# EAGLE design R2D2 Main Board (EAGLE 9.5.2)
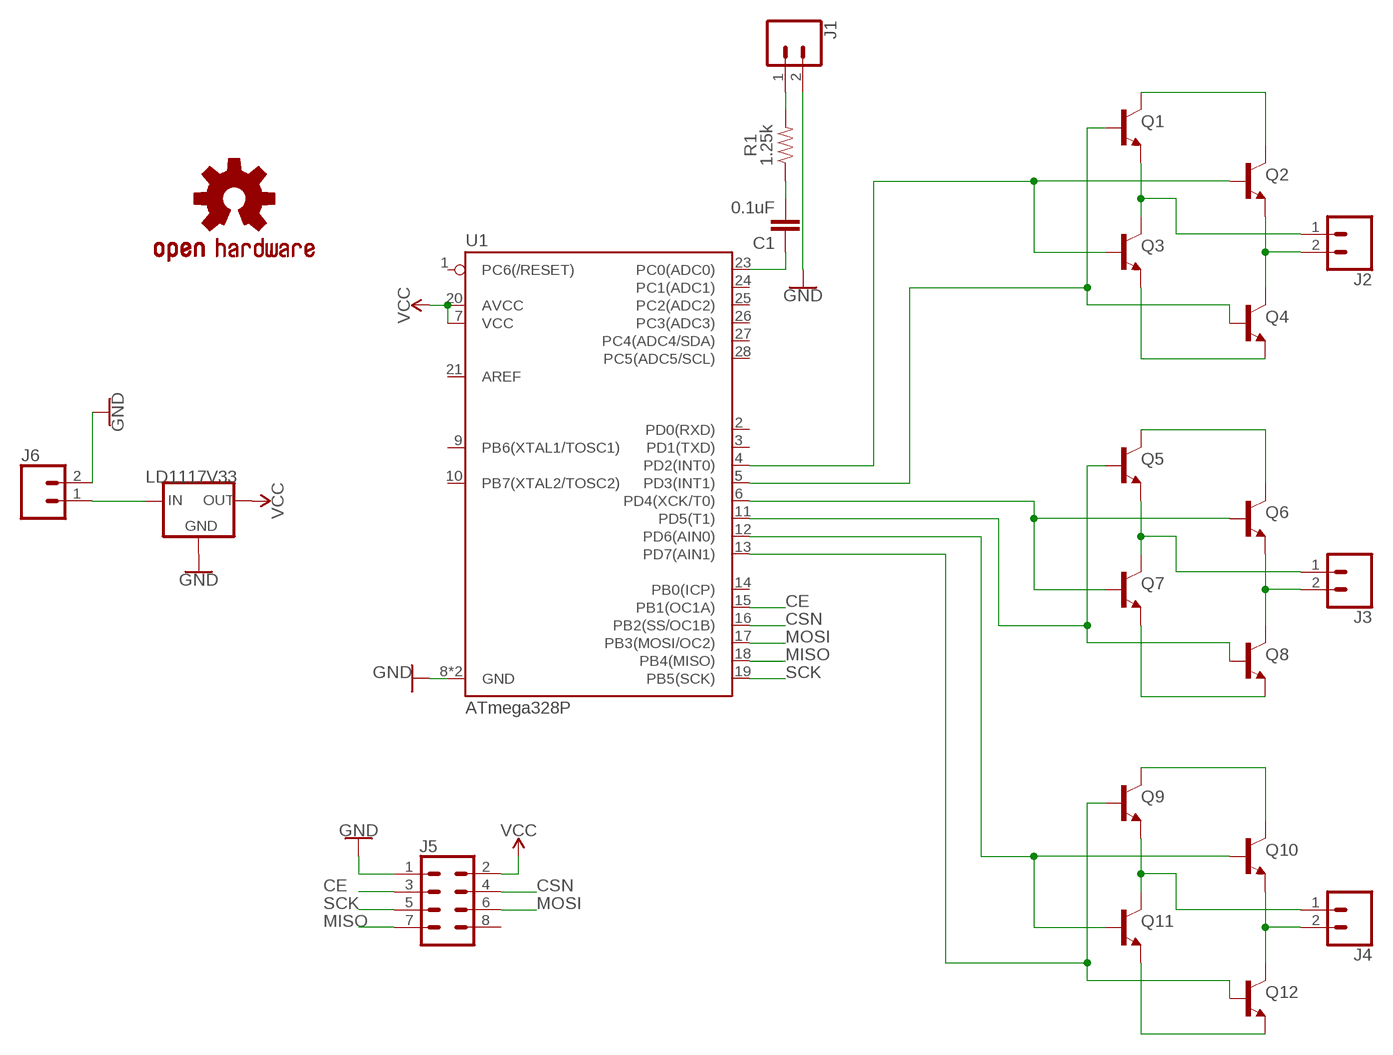
[diagram p0: schematic, sheet 1]

## Parts
C1  0.1uF  0.1UF-KIT-EZ-50V-20%  [CAP-PTH-SMALL-KIT]
J1  CONN_02  [1X02]
J2  CONN_02  [1X02]
J3  CONN_02  [1X02]
J4  CONN_02  [1X02]
J5  CONN_04X2  [2X4]
J6  CONN_02  [1X02]
LOGO1  OSHW-LOGOL  [OSHW-LOGO-L]
Q1  200mA/40V  TRANS_NPN-2N3904  [TO-92]
Q2  200mA/40V  TRANS_NPN-2N3904  [TO-92]
Q3  200mA/40V  TRANS_NPN-2N3904  [TO-92]
Q4  200mA/40V  TRANS_NPN-2N3904  [TO-92]
Q5  200mA/40V  TRANS_NPN-2N3904  [TO-92]
Q6  200mA/40V  TRANS_NPN-2N3904  [TO-92]
Q7  200mA/40V  TRANS_NPN-2N3904  [TO-92]
Q8  200mA/40V  TRANS_NPN-2N3904  [TO-92]
Q9  200mA/40V  TRANS_NPN-2N3904  [TO-92]
Q10  200mA/40V  TRANS_NPN-2N3904  [TO-92]
Q11  200mA/40V  TRANS_NPN-2N3904  [TO-92]
Q12  200mA/40V  TRANS_NPN-2N3904  [TO-92]
R1  1.25k  15KOHM-HORIZ-1/4W-5%  [AXIAL-0.3]
U1  ATmega328P  ATMEGA328P_PDIP  [DIP28]
U$1  LD1117V33  V_REG_LD1117VXX  [78XXL]

## Nets
CE: J5.3 U1.15(PB1(OC1A))
CSN: J5.4 U1.16(PB2(SS/OC1B))
GND: J1.2 J5.1 J6.2 U1.8(GND) U1.22(GND) U$1.IN(GND)
MISO: J5.7 U1.18(PB4(MISO))
MOSI: J5.6 U1.17(PB3(MOSI/OC2))
N$1: Q1.3(C) Q2.3(C)
N$2: Q3.1(E) Q4.1(E)
N$3: J2.2 Q2.1(E) Q4.3(C)
N$4: J2.1 Q1.1(E) Q3.3(C)
N$5: Q2.2(B) Q3.2(B) U1.4(PD2(INT0))
N$6: Q1.2(B) Q4.2(B) U1.5(PD3(INT1))
N$7: Q5.3(C) Q6.3(C)
N$8: Q7.1(E) Q8.1(E)
N$9: J3.2 Q6.1(E) Q8.3(C)
N$10: J3.1 Q5.1(E) Q7.3(C)
N$11: Q6.2(B) Q7.2(B) U1.6(PD4(XCK/T0))
N$12: Q5.2(B) Q8.2(B) U1.11(PD5(T1))
N$13: Q9.3(C) Q10.3(C)
N$14: Q11.1(E) Q12.1(E)
N$15: J4.2 Q10.1(E) Q12.3(C)
N$16: J4.1 Q9.1(E) Q11.3(C)
N$17: Q10.2(B) Q11.2(B) U1.12(PD6(AIN0))
N$18: Q9.2(B) Q12.2(B) U1.13(PD7(AIN1))
N$19: C1.1 U1.23(PC0(ADC0))
N$20: C1.2 R1.P$1
N$21: J1.1 R1.P$2
SCK: J5.5 U1.19(PB5(SCK))
VCC: J5.2 U1.7(VCC) U1.20(AVCC) U$1.GND(OUT)
VIN: J6.1 U$1.OUT(IN)
Unconnected: J5.8 U1.1(PC6(/RESET)) U1.2(PD0(RXD)) U1.3(PD1(TXD)) U1.9(PB6(XTAL1/TOSC1)) U1.10(PB7(XTAL2/TOSC2)) U1.14(PB0(ICP)) U1.21(AREF) U1.24(PC1(ADC1)) U1.25(PC2(ADC2)) U1.26(PC3(ADC3)) U1.27(PC4(ADC4/SDA)) U1.28(PC5(ADC5/SCL))

## Library data of the parts
C1 = SparkFun-Capacitors:0.1UF: 0.1µF ceramic capacitors A capacitor is a passive two-terminal electrical component used to store electrical energy temporarily in an electric field.; PROD_ID: CAP-08370
J1-J4 J6 = SparkFun-Connectors:CONN_02: Multi connection point. Often used as Generic Header-pin footprint for 0.1 inch spaced/style header connections On any of the 0.1 inch spaced packages, you can populate with these: Break Away Headers - Straight <https://www.sparkfun.com/products/116> (PRT-00116) Break Away Male Headers - Right Angle <https://www.sparkfun.com/products/553> (PRT-00553) Female Headers <https://www.sparkfun.com/products/115> (PRT-00115) Break Away Headers - Machine Pin <https://www.sparkfun.com/products/117> (PRT-00117) Break Away Female Headers - Swiss Machine Pin <https://www.sparkfun.com/products/743> (PRT-00743) For SCREWTERMINALS and SPRING TERMINALS visit here: Screw Terimnals on SparkFun.com <https://www.sparkfun.com/search/results?term=Screw+Terminals> (5mm/3.5mm/2.54mm spacing) This device is also useful as a general connection point to wire up your design to another part of your project. Our various solder wires solder well into these plated through hole pads. Hook-Up Wire - Assortment (Stranded, 22 AWG) <https://www.sparkfun.com/products/11375> (PRT-11375) Hook-Up Wire - Assortment (Solid Core, 22 AWG) <https://www.sparkfun.com/products/11367> (PRT-11367) View the entire wire category on our website here <https://www.sparkfun.com/categories/141> Special notes: Molex polarized connector foot print use with: PRT-08233 with associated crimp pins and housings. 2.54_SCREWTERM for use with PRT-10571. 3.5mm Screw Terminal footprints for PRT-08084 5mm Screw Terminal footprints for use with PRT-08432
J5 = SparkFun-Connectors:CONN_04X2: Multi connection point. Often used as Generic Header-pin footprint for 0.1 inch spaced/style header connections On any of the 0.1 inch spaced packages, you can populate with these: Break Away Headers - Straight <https://www.sparkfun.com/products/116> (PRT-00116) Break Away Male Headers - Right Angle <https://www.sparkfun.com/products/553> (PRT-00553) Female Headers <https://www.sparkfun.com/products/115> (PRT-00115) Break Away Headers - Machine Pin <https://www.sparkfun.com/products/117> (PRT-00117) Break Away Female Headers - Swiss Machine Pin <https://www.sparkfun.com/products/743> (PRT-00743)
LOGO1 = SparkFun-Aesthetics:OSHW-LOGO: Open-Source Hardware (OSHW) Logo This logo indicates the piece of hardware it is found on incorporates a OSHW license and/or adheres to the definition of open source hardware found here: http://freedomdefined.org/OSHW
Q1-Q12 = SparkFun-DiscreteSemi:TRANS_NPN: NPN transistor Current controlled devices typically used to amplify current or used as a switch. BC547 - COM-08928 <http://www.sparkfun.com/products/8928> (TO-92 45V 100mA) (1.Collector 2.Base 3.Emitter) 2N3904 - COM-00521 <http://www.sparkfun.com/products/521> (TO-92 40V 200mA) (1.Emitter 2.Base 3.Collector) P2N2222A - COM-12852 <http://www.sparkfun.com/products/12852> (TO-92 40V 600mA) (1.Collector 2.Base 3.Emitter); PROD_ID: TRANS-08447
R1 = SparkFun-Resistors:15KOHM: 15kΩ resistor A resistor is a passive two-terminal electrical component that implements electrical resistance as a circuit element. Resistors act to reduce current flow, and, at the same time, act to lower voltage levels within circuits. - Wikipedia; PROD_ID: RES-11360; VALUE: 15k
U1 = SparkFun-IC-Microcontroller:ATMEGA328P_PDIP: Atmel 328P Through hole ATMEGA328P uC used in the Arduino 32kb flash, 1k EEPROM, 2k SRAM Datasheet <http://www.sparkfun.com/datasheets/Components/SMD/ATMega328.pdf> SparkFun Products Storefront component: AVR 28 Pin 20MHz 32K 6A/D - ATMega328P <https://www.sparkfun.com/products/9061> (COM-09061) SparkFun Simon Says - Through-Hole Soldering Kit <https://www.sparkfun.com/products/10547> (KIT-10547) SparkFun Learn to Solder - Simon Says <https://www.sparkfun.com/products/13708> (KIT-13708) SparkFun BigTime Watch Kit <https://www.sparkfun.com/products/11734> (KIT-11734) SparkFun ClockIt <https://www.sparkfun.com/products/10930> (KIT-10930) SparkFun Serial Enabled LCD Kit <https://www.sparkfun.com/products/10097> (LCD-10097) SparkFun Simon Tilts - Through Hole Soldering Kit <https://www.sparkfun.com/products/12634> (KIT-12634) SparkFun Frequency Counter Kit <https://www.sparkfun.com/products/10140> (KIT-10140) FabFM Radio Kit <https://www.sparkfun.com/products/11043> (KIT-11043) SparkFun Binary Blaster Kit <https://www.sparkfun.com/products/12037> (KIT-12037) SparkFun Metro-Gnome <https://www.sparkfun.com/products/9236> (KIT-09236) ATmega328 with Arduino Optiboot (Uno) <https://www.sparkfun.com/products/10524> (DEV-10524); PROD_ID: IC-09136; VALUE: 328P
U$1 = SparkFun-IC-Power:V_REG_LD1117VXX: LD1117VXX voltage regulator. We carry the 3.3V version (COM-00526) in TO-220 package.

## Board
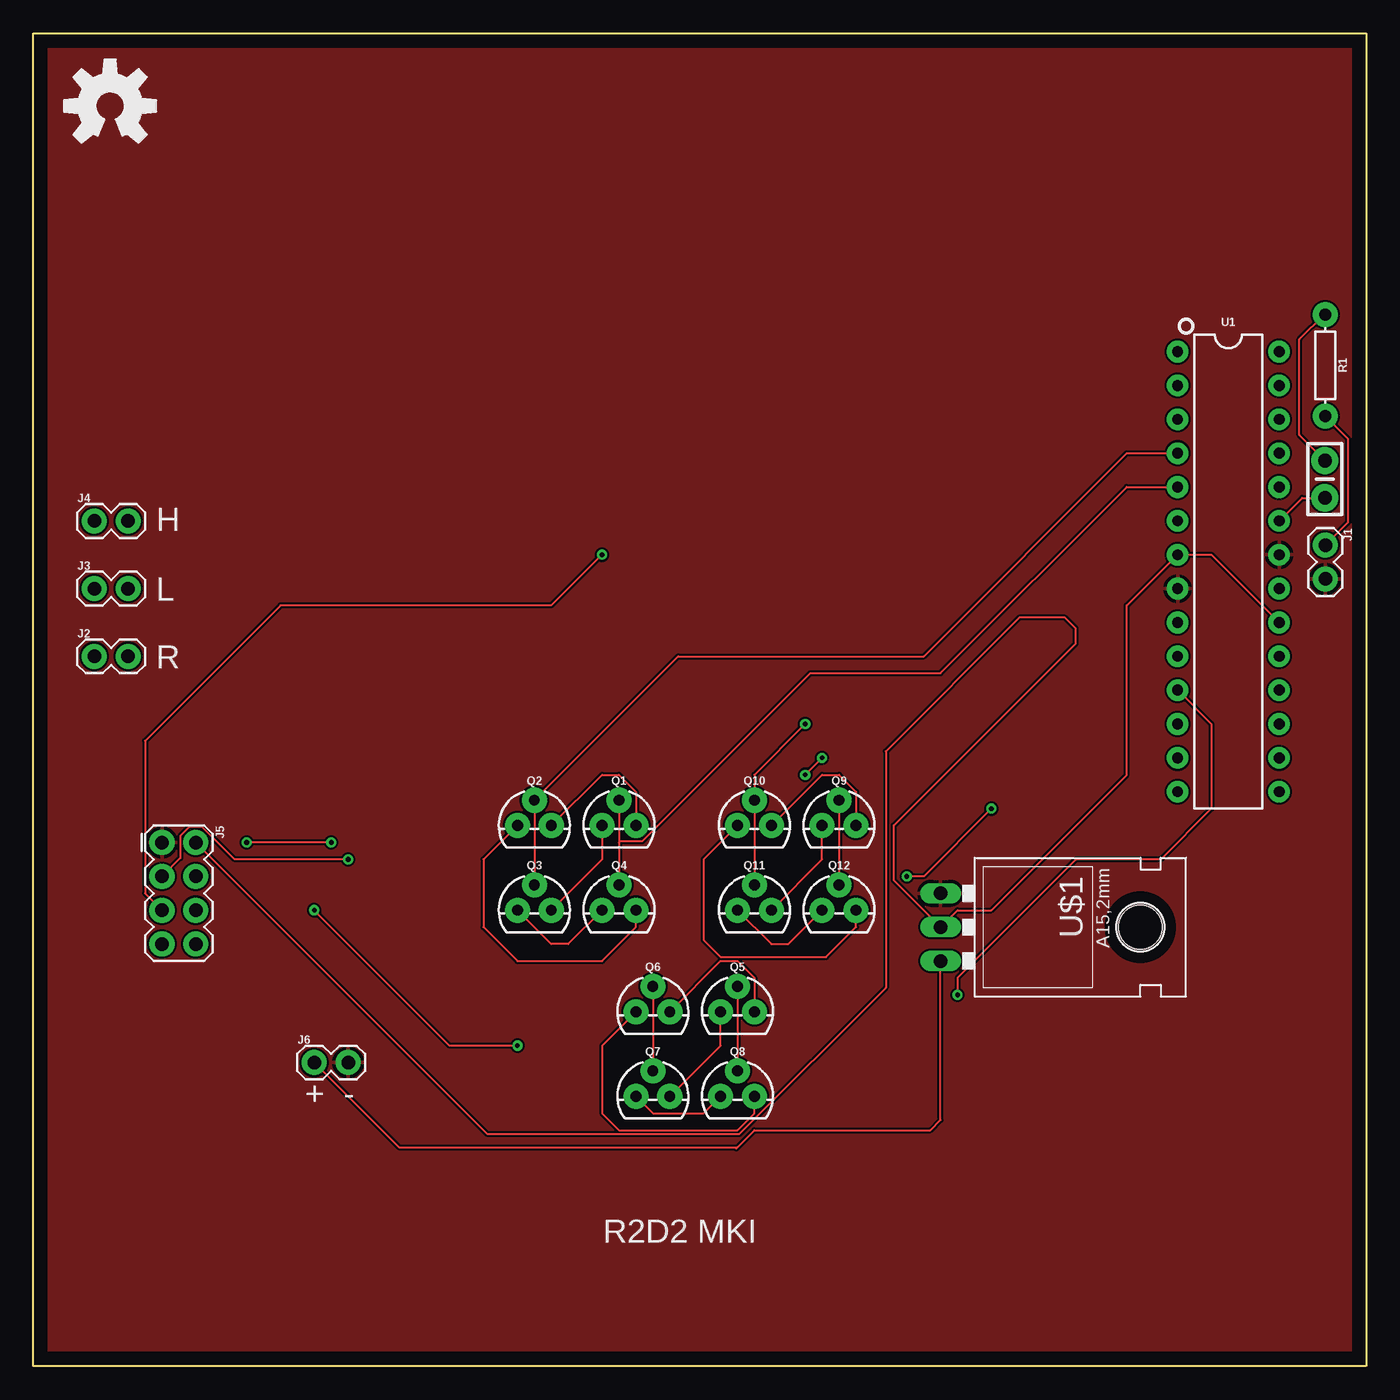
[diagram p1: board, top side]
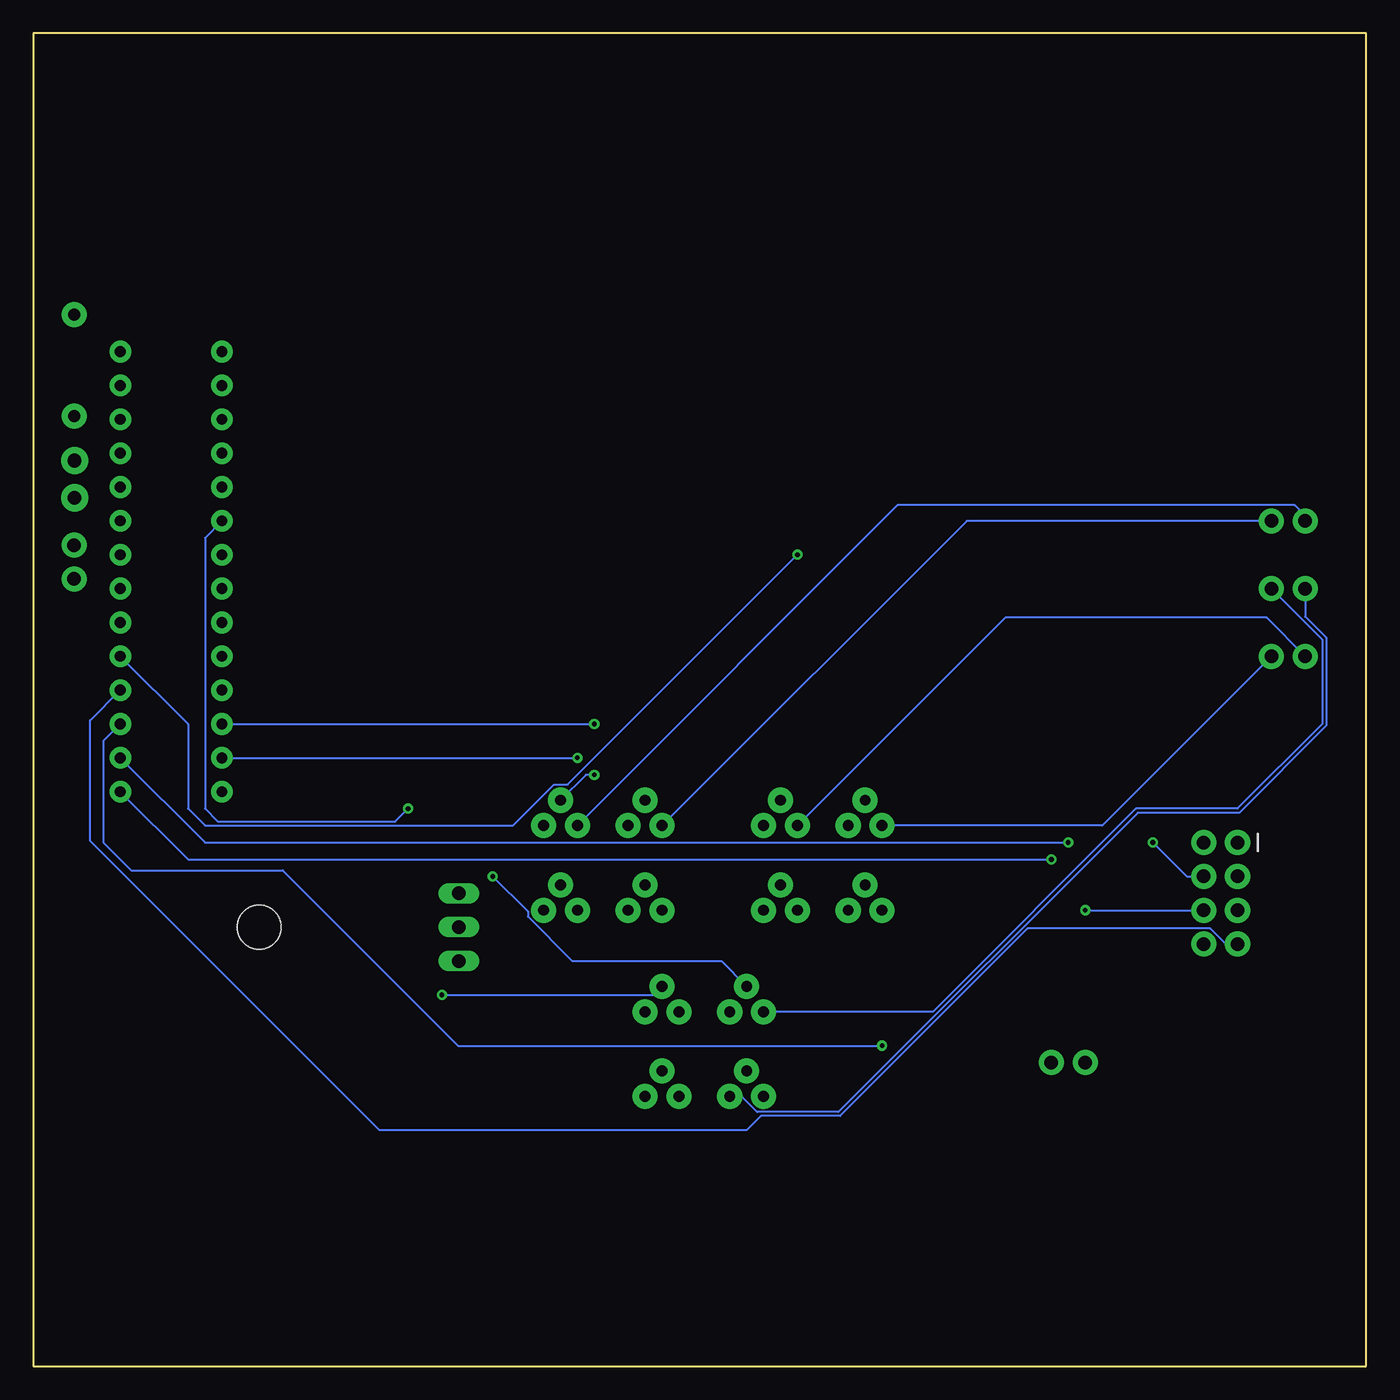
[diagram p2: board, bottom side, seen from below]

Size 100 x 100 mm. Coordinates in mm from the lower left corner, seen from the top.
Outline: 0,0 0,100 100,100 100,0 0,0
Copper layers (1*16): Top 0.035mm / dielectric 1.5mm / Bottom 0.035mm
Design rules "default": minimum track width 6mil, minimum drill 0.35mm, track to track 6mil, track to pad 6mil, pad to pad 6mil, via to via 6mil, smd to smd 6mil, copper to edge 40mil, drill to drill 6mil, minimum pad ring 10mil, minimum via ring 8mil, stop-mask expansion 4mil, vias tented up to drill 0mil, thermal gap 10mil

### Footprints (pad centres in the part's own frame; a part is rotated, then mirrored left to right if it is on the bottom)
CAP-PTH-SMALL-KIT = drill 1.016 pad 2.032: 1 -1.397,0; 2 1.397,0
1X02 = drill 1.016 pad 1.88: 1 0,0; 2 2.54,0
2X4 = drill 1.016 pad 1.88: 1 -3.81,-1.27; 2 -3.81,1.27; 3 -1.27,-1.27; 4 -1.27,1.27; 5 1.27,-1.27; 6 1.27,1.27; 7 3.81,-1.27; 8 3.81,1.27
TO-92 = drill 0.813 pad 1.88: 1 -1.27,0; 2 0,1.905; 3 1.27,0
AXIAL-0.3 = drill 0.9 pad 1.88: P$1 -3.81,0; P$2 3.81,0
DIP28 = drill 0.813 pad 1.626: 1 -16.51,-3.81; 2 -13.97,-3.81; 3 -11.43,-3.81; 4 -8.89,-3.81; 5 -6.35,-3.81; 6 -3.81,-3.81; 7 -1.27,-3.81; 8 1.27,-3.81; 9 3.81,-3.81; 10 6.35,-3.81; 11 8.89,-3.81; 12 11.43,-3.81; 13 13.97,-3.81; 14 16.51,-3.81; 15 16.51,3.81; 16 13.97,3.81; 17 11.43,3.81; 18 8.89,3.81; 19 6.35,3.81; 20 3.81,3.81; 21 1.27,3.81; 22 -1.27,3.81; 23 -3.81,3.81; 24 -6.35,3.81; 25 -8.89,3.81; 26 -11.43,3.81; 27 -13.97,3.81; 28 -16.51,3.81
78XXL = drill 1.016 long: GND 0,-3.81; IN -2.54,-3.81; OUT 2.54,-3.81 | hole 3.302: 0,11.176

### Placement (x,y rotation side)
C1  96.9,66.55 90 top
J1  96.94,61.6 270 top
J2  4.57,53.26 0 top
J3  4.57,58.34 0 top
J4  4.57,63.42 0 top
J5  10.92,35.48 270 top
J6  21.08,22.78 0 top
LOGO1  5.76,94.55 0 top
Q1  43.94,40.56 0 top
Q2  37.59,40.56 0 top
Q3  37.59,34.21 0 top
Q4  43.94,34.21 0 top
Q5  52.83,26.59 0 top
Q6  46.48,26.59 0 top
Q7  46.48,20.24 0 top
Q8  52.83,20.24 0 top
Q9  60.45,40.56 0 top
Q10  54.1,40.56 0 top
Q11  54.1,34.21 0 top
Q12  60.45,34.21 0 top
R1  96.93,75.1 270 top
U1  89.66,59.61 270 top
U$1  71.88,32.94 270 top

### Tracks (layer width: path | path; a pad name or v marks a point on that pad's centre or on a via)
CE  (via drill 0.35)
  Top 0.152: v23.62,38.02 15.11,38.02 12.68,40.46 11.71,40.46 11.02,39.77 11.02,38.12 J5.3
  Bottom 0.152: U1.15 88.39,38.02 v23.62,38.02
CSN  (via drill 0.35)
  Top 0.152: v22.35,39.29 v16,39.29
  Bottom 0.152: U1.16 87.12,39.29 v22.35,39.29 | v16,39.29 13.46,36.75 J5.4
GND
  pour Top: 0,0 0,100 100,100 100,0
MISO
  Bottom 0.152: J5.7 10.54,31.67 11.71,32.84 25.4,32.84 39.47,18.77 45.41,18.77 46.48,17.7 74.02,17.7 95.73,39.42 95.73,48.46 U1.18
MOSI  (via drill 0.35)
  Top 0.152: v36.32,24.05 31.24,24.05 v21.08,34.21
  Bottom 0.152: U1.17 94.74,46.91 94.74,39.29 92.66,37.21 81.29,37.21 68.13,24.05 v36.32,24.05 | v21.08,34.21 J5.6
N$1
  Top 0.152: Q2.3 42.67,44.37 43.94,44.37 45.21,43.1 Q1.3
N$2
  Top 0.152: Q4.1 40.13,31.67 38.86,31.67 Q3.1
N$3
  Top 0.152: Q2.1 33.78,38.02 33.78,32.94 36.32,30.4 42.67,30.4 45.21,32.94 Q4.3
  Bottom 0.152: J2.2 19.81,40.56 Q2.1
N$4
  Top 0.152: Q1.1 42.67,38.02 Q3.3
  Bottom 0.152: Q1.1 27.07,56.16 7.47,56.16 J2.1
N$5
  Top 0.152: Q3.2 Q2.2 48.39,53.26 66.8,53.26 82.04,68.5 U1.4
N$6
  Top 0.152: Q1.2 43.94,39.29 | 43.94,39.29 Q4.2 | 43.94,39.29 44.04,39.39 45.7,39.39 58.29,51.99 68.07,51.99 82.04,65.96 U1.5
N$7
  Top 0.152: Q6.3 51.56,30.4 52.83,30.4 54.1,29.13 Q5.3
N$8
  Top 0.152: Q7.1 46.48,18.97 50.29,18.97 Q8.1
N$9
  Top 0.152: Q6.1 42.67,24.05 42.67,18.97 43.94,17.7 52.83,17.7 54.1,18.97 Q8.3
  Bottom 0.152: J3.2 3.3,54.53 3.3,48.18 9.65,41.83 17.27,41.83 32.51,26.59 Q6.1
N$10
  Top 0.152: Q7.3 51.56,24.05 Q5.1
  Bottom 0.152: J3.1 4.57,56.23 3,54.66 3,48.05 9.53,41.52 17.14,41.52 39.6,19.07 45.7,19.07 46.86,20.24 Q7.3
N$11  (via drill 0.35)
  Top 0.152: Q6.2 Q7.2 | v71.88,41.83 66.8,36.75 v65.53,36.75
  Bottom 0.152: U1.6 87.12,62.15 87.12,41.83 86.16,40.86 72.85,40.86 v71.88,41.83 | v65.53,36.75 62.89,34.11 62.89,33.73 59.56,30.4 48.39,30.4 Q6.2
N$12  (via drill 0.35)
  Top 0.152: Q5.2 Q8.2 | U1.11 88.39,48.18 88.39,41.83 84.58,38.02 78.23,38.02 69.34,29.13 v69.34,27.86
  Bottom 0.152: v69.34,27.86 53.47,27.86 Q5.2
N$13
  Top 0.152: Q10.3 59.18,44.37 60.45,44.37 61.72,43.1 Q9.3
N$14
  Top 0.152: Q11.1 55.37,31.67 56.64,31.67 Q12.1
N$15
  Top 0.152: Q10.1 50.29,38.02 50.29,31.97 51.56,30.7 59.49,30.7 61.72,32.94 Q12.3
  Bottom 0.152: J4.2 29.97,63.42 Q10.1
N$16
  Top 0.152: Q11.3 59.18,38.02 Q9.1
  Bottom 0.152: J4.1 4.57,63.8 5.36,64.59 35.15,64.59 Q9.1
N$17  (via drill 0.35)
  Top 0.152: Q11.2 Q10.2 54.1,44.37 v57.91,48.18
  Bottom 0.152: U1.12 v57.91,48.18
N$18  (via drill 0.35)
  Top 0.152: Q9.2 Q12.2 | v59.18,45.64 v57.91,44.37
  Bottom 0.152: U1.13 v59.18,45.64 | v57.91,44.37 58.55,44.37 Q9.2
N$19
  Top 0.152: U1.23 95.2,65.15 C1.1
N$20
  Top 0.152: C1.2 94.99,69.86 94.99,77.04 96.85,78.91 R1.P$1
N$21
  Top 0.152: R1.P$2 98.64,69.58 98.64,63.3 J1.1
SCK  (via drill 0.35)
  Top 0.152: v42.67,60.88 38.86,57.07 18.54,57.07 8.38,46.91 8.38,35.48 J5.5
  Bottom 0.152: U1.19 88.39,48.18 88.39,41.83 87.12,40.56 64.01,40.56 60.94,43.63 59.92,43.63 v42.67,60.88
VCC
  Top 0.152: J5.2 34.09,17.39 52.96,17.39 63.96,28.39 63.96,46.13 73.98,56.16 77.4,56.16 78.21,55.35 78.21,54.22 64.57,40.58 64.57,36.45 U$1.GND 69.34,34.21 71.88,34.21 82.04,44.37 82.04,57.07 U1.7 88.39,60.88 U1.20
VIN
  Top 0.152: 52.74,16.34 52.83,16.43 | 52.83,16.43 54.1,17.7 67.3,17.7 68.07,18.47 U$1.OUT | J6.1 27.43,16.43 52.83,16.43

### Text on the board
tNames: H | L | R | + - | R2D2 MKI